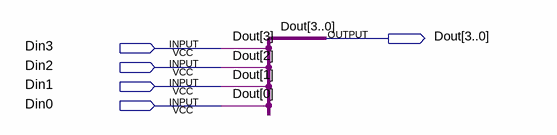
[diagram p0: schematic sheet]
// Quartus schematic cvt_1x4_4x1.bdf as structural Verilog: 0 symbols, 5 pins
module cvt_1x4_4x1 (
  input  Din3,
  input  Din2,
  input  Din1,
  input  Din0,
  output [3:0] Dout
);


  assign Dout = {Din3, Din2, Din1, Din0};
endmodule
